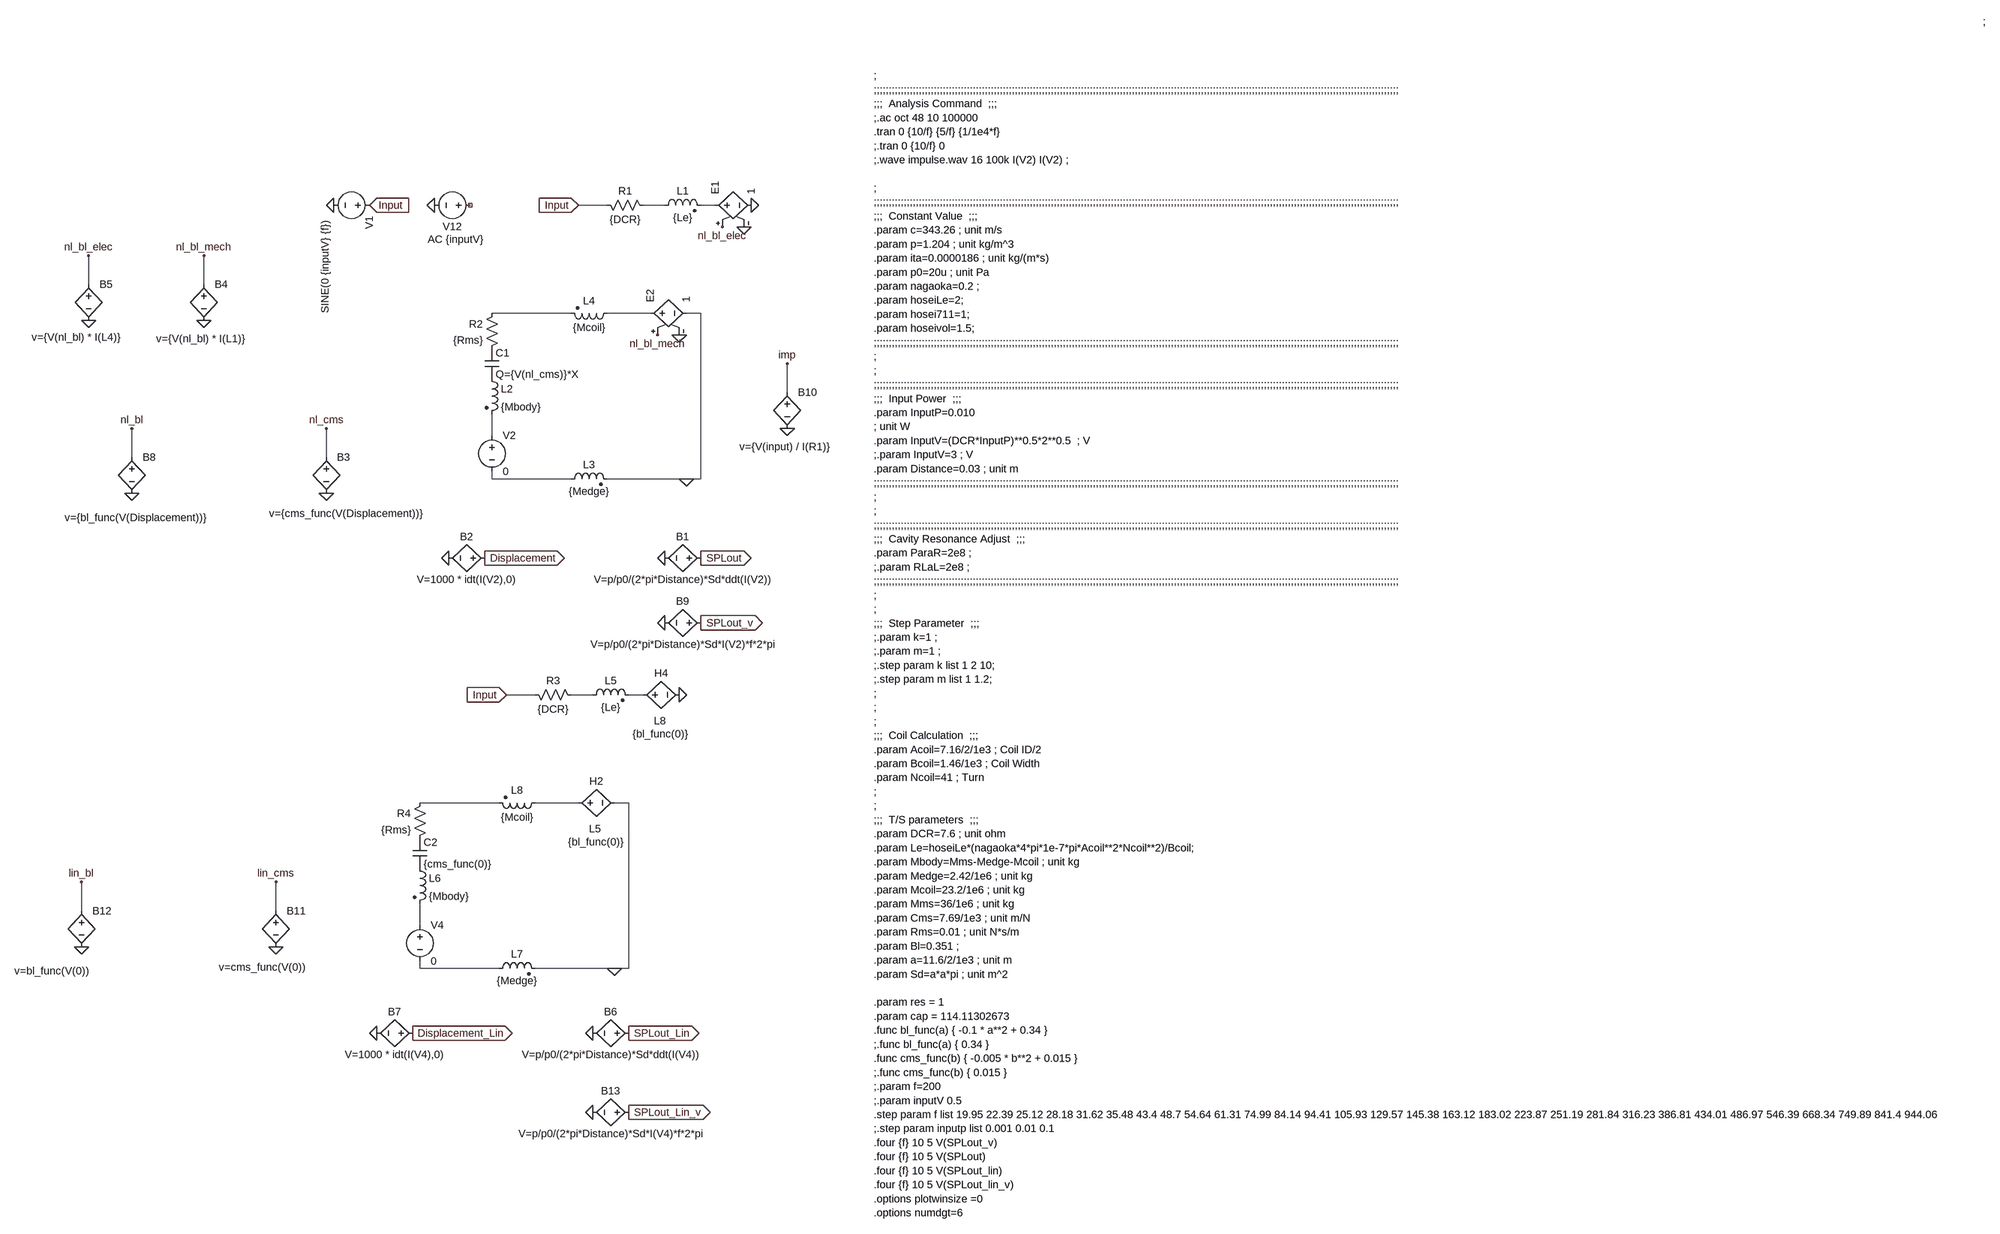
[diagram p0: schematic demo_11_10mw.asc]
demo_11_10mw.asc, the LTspice schematic file:
Version 4
SHEET 1 6896 9720
WIRE -2672 -416 -2736 -416
WIRE -2544 -416 -2592 -416
WIRE -2432 -416 -2464 -416
WIRE -3824 -240 -3824 -304
WIRE -3568 -240 -3568 -304
WIRE -2752 -176 -2928 -176
WIRE -2576 -176 -2672 -176
WIRE -2464 -176 -2496 -176
WIRE -2272 0 -2272 -64
WIRE -2928 96 -2928 48
WIRE -3728 144 -3728 80
WIRE -3296 144 -3296 80
WIRE -2928 192 -2928 176
WIRE -2752 192 -2928 192
WIRE -2496 192 -2672 192
WIRE -2464 192 -2464 -176
WIRE -2464 192 -2496 192
WIRE -2832 672 -2896 672
WIRE -2704 672 -2752 672
WIRE -2592 672 -2624 672
WIRE -2912 912 -3088 912
WIRE -2736 912 -2832 912
WIRE -2624 912 -2656 912
WIRE -3840 1152 -3840 1088
WIRE -3408 1152 -3408 1088
WIRE -3088 1184 -3088 1136
WIRE -3088 1280 -3088 1264
WIRE -2912 1280 -3088 1280
WIRE -2656 1280 -2832 1280
WIRE -2624 1280 -2624 912
WIRE -2624 1280 -2656 1280
FLAG -3056 -416 0
FLAG -3200 -416 Input
IOPIN -3200 -416 In
FLAG -2352 -416 0
FLAG -2736 -416 Input
IOPIN -2736 -416 In
FLAG -2496 192 0
FLAG -2464 368 SPLout
IOPIN -2464 368 Out
FLAG -2544 368 0
FLAG -2944 368 Displacement
IOPIN -2944 368 Out
FLAG -3024 368 0
FLAG -3280 -416 0
FLAG -3296 224 0
FLAG -3296 80 nl_cms
FLAG -3568 -160 0
FLAG -3568 -304 nl_bl_mech
FLAG -3824 -160 0
FLAG -3824 -304 nl_bl_elec
FLAG -2416 -368 nl_bl_elec
FLAG -2560 -128 nl_bl_mech
FLAG -2512 -128 0
FLAG -2368 -368 0
FLAG -2512 672 0
FLAG -2896 672 Input
IOPIN -2896 672 In
FLAG -2656 1280 0
FLAG -2624 1424 SPLout_Lin
IOPIN -2624 1424 Out
FLAG -2704 1424 0
FLAG -3104 1424 Displacement_Lin
IOPIN -3104 1424 Out
FLAG -3184 1424 0
FLAG -3728 224 0
FLAG -3728 80 nl_bl
FLAG -2464 512 SPLout_v
IOPIN -2464 512 Out
FLAG -2544 512 0
FLAG -2272 80 0
FLAG -2272 -64 imp
FLAG -3408 1232 0
FLAG -3408 1088 lin_cms
FLAG -3840 1232 0
FLAG -3840 1088 lin_bl
FLAG -2624 1600 SPLout_Lin_v
IOPIN -2624 1600 Out
FLAG -2704 1600 0
SYMBOL voltage -2960 -416 R90
WINDOW 0 32 56 VTop 2
WINDOW 3 -32 56 VBottom 2
WINDOW 123 60 48 VTop 2
SYMATTR InstName V12
SYMATTR Value ""
SYMATTR Value2 AC {inputV}
SYMBOL res -2688 -432 M90
WINDOW 0 0 56 VBottom 2
WINDOW 3 32 56 VTop 2
SYMATTR InstName R1
SYMATTR Value {DCR}
SYMBOL ind2 -2560 -400 R270
WINDOW 0 32 56 VTop 2
WINDOW 3 4 56 VBottom 2
SYMATTR InstName L1
SYMATTR Value {Le}
SYMATTR Type ind
SYMBOL res -2912 -192 M0
SYMATTR InstName R2
SYMATTR Value {Rms}
SYMBOL cap -2944 -96 R0
SYMATTR InstName C1
SYMATTR Value Q={V(nl_cms)}*X
SYMBOL h -2752 912 R270
WINDOW 0 32 56 VTop 2
WINDOW 3 -71 55 VBottom 2
WINDOW 38 -42 53 VBottom 2
SYMATTR InstName H2
SYMATTR Value {bl_func(0)}
SYMATTR SpiceModel L5
SYMBOL ind2 -2944 -48 R0
SYMATTR InstName L2
SYMATTR Value {Mbody}
SYMBOL voltage -2928 80 R0
SYMATTR InstName V2
SYMATTR Value 0
SYMBOL ind2 -2768 208 R270
WINDOW 0 32 56 VTop 2
WINDOW 3 4 56 VBottom 2
SYMATTR InstName L3
SYMATTR Value {Medge}
SYMBOL ind2 -2656 -192 R90
WINDOW 0 4 56 VBottom 2
WINDOW 3 32 56 VTop 2
SYMATTR InstName L4
SYMATTR Value {Mcoil}
SYMBOL bv -2448 368 R90
WINDOW 0 -32 56 VBottom 2
WINDOW 3 32 56 VTop 2
SYMATTR InstName B1
SYMATTR Value V=p/p0/(2*pi*Distance)*Sd*ddt(I(V2))
SYMBOL bv -2928 368 R90
WINDOW 0 -32 56 VBottom 2
WINDOW 3 32 56 VTop 2
SYMATTR InstName B2
SYMATTR Value V=1000 * idt(I(V2),0)
SYMBOL h -2608 672 R270
WINDOW 0 32 56 VTop 2
WINDOW 3 -71 55 VBottom 2
WINDOW 38 -42 53 VBottom 2
SYMATTR InstName H4
SYMATTR Value {bl_func(0)}
SYMATTR SpiceModel L8
SYMBOL voltage -3184 -416 R90
WINDOW 3 33 114 Left 2
WINDOW 123 24 38 Left 2
SYMATTR Value SINE(0 {inputV} {f})
SYMATTR InstName V1
SYMBOL bv -3296 128 R0
WINDOW 3 -127 141 Left 2
SYMATTR Value v={cms_func(V(Displacement))}
SYMATTR InstName B3
SYMBOL bv -3568 -256 R0
WINDOW 3 -106 137 Left 2
SYMATTR Value v={V(nl_bl) * I(L1)}
SYMATTR InstName B4
SYMBOL bv -3824 -256 R0
WINDOW 3 -127 133 Left 2
SYMATTR Value v={V(nl_bl) * I(L4)}
SYMATTR InstName B5
SYMBOL e -2448 -416 R270
SYMATTR InstName E1
SYMATTR Value 1
SYMBOL e -2592 -176 R270
SYMATTR InstName E2
SYMATTR Value 1
SYMBOL res -2848 656 M90
WINDOW 0 0 56 VBottom 2
WINDOW 3 32 56 VTop 2
SYMATTR InstName R3
SYMATTR Value {DCR}
SYMBOL ind2 -2720 688 R270
WINDOW 0 32 56 VTop 2
WINDOW 3 4 56 VBottom 2
SYMATTR InstName L5
SYMATTR Value {Le}
SYMATTR Type ind
SYMBOL res -3072 896 M0
SYMATTR InstName R4
SYMATTR Value {Rms}
SYMBOL cap -3104 992 R0
SYMATTR InstName C2
SYMATTR Value {cms_func(0)}
SYMBOL ind2 -3104 1040 R0
SYMATTR InstName L6
SYMATTR Value {Mbody}
SYMBOL voltage -3088 1168 R0
SYMATTR InstName V4
SYMATTR Value 0
SYMBOL ind2 -2928 1296 R270
WINDOW 0 32 56 VTop 2
WINDOW 3 4 56 VBottom 2
SYMATTR InstName L7
SYMATTR Value {Medge}
SYMBOL ind2 -2816 896 R90
WINDOW 0 4 56 VBottom 2
WINDOW 3 32 56 VTop 2
SYMATTR InstName L8
SYMATTR Value {Mcoil}
SYMBOL bv -2608 1424 R90
WINDOW 0 -32 56 VBottom 2
WINDOW 3 32 56 VTop 2
SYMATTR InstName B6
SYMATTR Value V=p/p0/(2*pi*Distance)*Sd*ddt(I(V4))
SYMBOL bv -3088 1424 R90
WINDOW 0 -32 56 VBottom 2
WINDOW 3 32 56 VTop 2
SYMATTR InstName B7
SYMATTR Value V=1000 * idt(I(V4),0)
SYMBOL bv -3728 128 R0
WINDOW 3 -149 150 Left 2
SYMATTR Value v={bl_func(V(Displacement))}
SYMATTR InstName B8
SYMBOL bv -2448 512 R90
WINDOW 0 -32 56 VBottom 2
WINDOW 3 32 56 VTop 2
SYMATTR InstName B9
SYMATTR Value V=p/p0/(2*pi*Distance)*Sd*I(V2)*f*2*pi
SYMBOL bv -2272 -16 R0
WINDOW 3 -106 137 Left 2
SYMATTR Value v={V(input) / I(R1)}
SYMATTR InstName B10
SYMBOL bv -3408 1136 R0
WINDOW 3 -127 141 Left 2
SYMATTR Value v=cms_func(V(0))
SYMATTR InstName B11
SYMBOL bv -3840 1136 R0
WINDOW 3 -149 150 Left 2
SYMATTR Value v=bl_func(V(0))
SYMATTR InstName B12
SYMBOL bv -2608 1600 R90
WINDOW 0 -32 56 VBottom 2
WINDOW 3 32 56 VTop 2
SYMATTR InstName B13
SYMATTR Value V=p/p0/(2*pi*Distance)*Sd*I(V4)*f*2*pi
TEXT -2080 -704 Left 2 !;\n;;;;;;;;;;;;;;;;;;;;;;;;;;;;;;;;;;;;;;;;;;;;;;;;;;;;;;;;;;;;;;;;;;;;;;;;;;;;;;;;;;;;;;;;;;;;;;;;;;;;;;;;;;;;;;;;;;;;;;;;;;;;;;;;;;;;;;;;;;;;;;;;;;;;;;;;;;;;;;;;;;;;;;;;;;;;;;;\n;;;  Analysis Command  ;;;\n;.ac oct 48 10 100000\n.tran 0 {10/f} {5/f} {1/1e4*f}\n;.tran 0 {10/f} 0\n;.wave impulse.wav 16 100k I(V2) I(V2) ;\n \n;\n;;;;;;;;;;;;;;;;;;;;;;;;;;;;;;;;;;;;;;;;;;;;;;;;;;;;;;;;;;;;;;;;;;;;;;;;;;;;;;;;;;;;;;;;;;;;;;;;;;;;;;;;;;;;;;;;;;;;;;;;;;;;;;;;;;;;;;;;;;;;;;;;;;;;;;;;;;;;;;;;;;;;;;;;;;;;;;;\n;;;  Constant Value  ;;;\n.param c=343.26 ; unit m/s\n.param p=1.204 ; unit kg/m^3\n.param ita=0.0000186 ; unit kg/(m*s)\n.param p0=20u ; unit Pa\n.param nagaoka=0.2 ; \n.param hoseiLe=2;\n.param hosei711=1;\n.param hoseivol=1.5;\n;;;;;;;;;;;;;;;;;;;;;;;;;;;;;;;;;;;;;;;;;;;;;;;;;;;;;;;;;;;;;;;;;;;;;;;;;;;;;;;;;;;;;;;;;;;;;;;;;;;;;;;;;;;;;;;;;;;;;;;;;;;;;;;;;;;;;;;;;;;;;;;;;;;;;;;;;;;;;;;;;;;;;;;;;;;;;;;\n;\n;\n;;;;;;;;;;;;;;;;;;;;;;;;;;;;;;;;;;;;;;;;;;;;;;;;;;;;;;;;;;;;;;;;;;;;;;;;;;;;;;;;;;;;;;;;;;;;;;;;;;;;;;;;;;;;;;;;;;;;;;;;;;;;;;;;;;;;;;;;;;;;;;;;;;;;;;;;;;;;;;;;;;;;;;;;;;;;;;;\n;;;  Input Power  ;;;\n.param InputP=0.010 \n; unit W\n.param InputV=(DCR*InputP)**0.5*2**0.5  ; V\n;.param InputV=3 ; V\n.param Distance=0.03 ; unit m\n;;;;;;;;;;;;;;;;;;;;;;;;;;;;;;;;;;;;;;;;;;;;;;;;;;;;;;;;;;;;;;;;;;;;;;;;;;;;;;;;;;;;;;;;;;;;;;;;;;;;;;;;;;;;;;;;;;;;;;;;;;;;;;;;;;;;;;;;;;;;;;;;;;;;;;;;;;;;;;;;;;;;;;;;;;;;;;;\n;\n;\n;;;;;;;;;;;;;;;;;;;;;;;;;;;;;;;;;;;;;;;;;;;;;;;;;;;;;;;;;;;;;;;;;;;;;;;;;;;;;;;;;;;;;;;;;;;;;;;;;;;;;;;;;;;;;;;;;;;;;;;;;;;;;;;;;;;;;;;;;;;;;;;;;;;;;;;;;;;;;;;;;;;;;;;;;;;;;;;\n;;;  Cavity Resonance Adjust  ;;;\n.param ParaR=2e8 ;\n;.param RLaL=2e8 ;\n;;;;;;;;;;;;;;;;;;;;;;;;;;;;;;;;;;;;;;;;;;;;;;;;;;;;;;;;;;;;;;;;;;;;;;;;;;;;;;;;;;;;;;;;;;;;;;;;;;;;;;;;;;;;;;;;;;;;;;;;;;;;;;;;;;;;;;;;;;;;;;;;;;;;;;;;;;;;;;;;;;;;;;;;;;;;;;;\n;\n;\n;;;  Step Parameter  ;;;\n;.param k=1 ;\n;.param m=1 ;\n;.step param k list 1 2 10;\n;.step param m list 1 1.2;\n;\n;\n;\n;;;  Coil Calculation  ;;;\n.param Acoil=7.16/2/1e3 ; Coil ID/2\n.param Bcoil=1.46/1e3 ; Coil Width\n.param Ncoil=41 ; Turn\n;\n;\n;;;  T/S parameters  ;;;\n.param DCR=7.6 ; unit ohm\n.param Le=hoseiLe*(nagaoka*4*pi*1e-7*pi*Acoil**2*Ncoil**2)/Bcoil; \n.param Mbody=Mms-Medge-Mcoil ; unit kg\n.param Medge=2.42/1e6 ; unit kg\n.param Mcoil=23.2/1e6 ; unit kg\n.param Mms=36/1e6 ; unit kg\n.param Cms=7.69/1e3 ; unit m/N\n.param Rms=0.01 ; unit N*s/m\n.param Bl=0.351 ;\n.param a=11.6/2/1e3 ; unit m\n.param Sd=a*a*pi ; unit m^2\n \n.param res = 1\n.param cap = 114.11302673\n.func bl_func(a) { -0.1 * a**2 + 0.34 }\n;.func bl_func(a) { 0.34 }\n.func cms_func(b) { -0.005 * b**2 + 0.015 }\n;.func cms_func(b) { 0.015 }\n;.param f=200\n;.param inputV 0.5\n.step param f list 19.95 22.39 25.12 28.18 31.62 35.48 43.4 48.7 54.64 61.31 74.99 84.14 94.41 105.93 129.57 145.38 163.12 183.02 223.87 251.19 281.84 316.23 386.81 434.01 486.97 546.39 668.34 749.89 841.4 944.06\n;.step param inputp list 0.001 0.01 0.1\n.four {f} 10 5 V(SPLout_v)\n.four {f} 10 5 V(SPLout)\n.four {f} 10 5 V(SPLout_lin)\n.four {f} 10 5 V(SPLout_lin_v) \n.options plotwinsize =0\n.options numdgt=6
TEXT 2064 -1288 Left 2 !;

The netlist it stands for:
* demo_11_10mw.asc
V12 NC_01 0 AC {inputV}
R1 Input N001 {DCR}
L1 N001 N002 {Le}
R2 N003 P001 {Rms}
C1 P001 P002 Q={V(nl_cms)}*X
H2 N010 0 L5 {bl_func(0)}
L2 P002 N005 {Mbody}
V2 N005 N006 0
L3 N006 0 {Medge}
L4 N004 N003 {Mcoil}
B1 SPLout 0 V=p/p0/(2*pi*Distance)*Sd*ddt(I(V2))
B2 Displacement 0 V=1000 * idt(I(V2),0)
H4 N008 0 L8 {bl_func(0)}
V1 Input 0 SINE(0 {inputV} {f})
B3 nl_cms 0 v={cms_func(V(Displacement))}
B4 nl_bl_mech 0 v={V(nl_bl) * I(L1)}
B5 nl_bl_elec 0 v={V(nl_bl) * I(L4)}
E1 N002 0 nl_bl_elec 0 1
E2 N004 0 nl_bl_mech 0 1
R3 Input N007 {DCR}
L5 N007 N008 {Le}
R4 N009 P003 {Rms}
C2 P003 P004 {cms_func(0)}
L6 P004 N011 {Mbody}
V4 N011 N012 0
L7 N012 0 {Medge}
L8 N010 N009 {Mcoil}
B6 SPLout_Lin 0 V=p/p0/(2*pi*Distance)*Sd*ddt(I(V4))
B7 Displacement_Lin 0 V=1000 * idt(I(V4),0)
B8 nl_bl 0 v={bl_func(V(Displacement))}
B9 SPLout_v 0 V=p/p0/(2*pi*Distance)*Sd*I(V2)*f*2*pi
B10 imp 0 v={V(input) / I(R1)}
B11 lin_cms 0 v=cms_func(V(0))
B12 lin_bl 0 v=bl_func(V(0))
B13 SPLout_Lin_v 0 V=p/p0/(2*pi*Distance)*Sd*I(V4)*f*2*pi
;
;;;;;;;;;;;;;;;;;;;;;;;;;;;;;;;;;;;;;;;;;;;;;;;;;;;;;;;;;;;;;;;;;;;;;;;;;;;;;;;;;;;;;;;;;;;;;;;;;;;;;;;;;;;;;;;;;;;;;;;;;;;;;;;;;;;;;;;;;;;;;;;;;;;;;;;;;;;;;;;;;;;;;;;;;;;;;;;
;;;  Analysis Command  ;;;
;.ac oct 48 10 100000
.tran 0 {10/f} {5/f} {1/1e4*f}
;.tran 0 {10/f} 0
;.wave impulse.wav 16 100k I(V2) I(V2) ;
;
;;;;;;;;;;;;;;;;;;;;;;;;;;;;;;;;;;;;;;;;;;;;;;;;;;;;;;;;;;;;;;;;;;;;;;;;;;;;;;;;;;;;;;;;;;;;;;;;;;;;;;;;;;;;;;;;;;;;;;;;;;;;;;;;;;;;;;;;;;;;;;;;;;;;;;;;;;;;;;;;;;;;;;;;;;;;;;;
;;;  Constant Value  ;;;
.param c=343.26 ; unit m/s
.param p=1.204 ; unit kg/m^3
.param ita=0.0000186 ; unit kg/(m*s)
.param p0=20u ; unit Pa
.param nagaoka=0.2 ;
.param hoseiLe=2;
.param hosei711=1;
.param hoseivol=1.5;
;;;;;;;;;;;;;;;;;;;;;;;;;;;;;;;;;;;;;;;;;;;;;;;;;;;;;;;;;;;;;;;;;;;;;;;;;;;;;;;;;;;;;;;;;;;;;;;;;;;;;;;;;;;;;;;;;;;;;;;;;;;;;;;;;;;;;;;;;;;;;;;;;;;;;;;;;;;;;;;;;;;;;;;;;;;;;;;
;
;
;;;;;;;;;;;;;;;;;;;;;;;;;;;;;;;;;;;;;;;;;;;;;;;;;;;;;;;;;;;;;;;;;;;;;;;;;;;;;;;;;;;;;;;;;;;;;;;;;;;;;;;;;;;;;;;;;;;;;;;;;;;;;;;;;;;;;;;;;;;;;;;;;;;;;;;;;;;;;;;;;;;;;;;;;;;;;;;
;;;  Input Power  ;;;
.param InputP=0.010
; unit W
.param InputV=(DCR*InputP)**0.5*2**0.5  ; V
;.param InputV=3 ; V
.param Distance=0.03 ; unit m
;;;;;;;;;;;;;;;;;;;;;;;;;;;;;;;;;;;;;;;;;;;;;;;;;;;;;;;;;;;;;;;;;;;;;;;;;;;;;;;;;;;;;;;;;;;;;;;;;;;;;;;;;;;;;;;;;;;;;;;;;;;;;;;;;;;;;;;;;;;;;;;;;;;;;;;;;;;;;;;;;;;;;;;;;;;;;;;
;
;
;;;;;;;;;;;;;;;;;;;;;;;;;;;;;;;;;;;;;;;;;;;;;;;;;;;;;;;;;;;;;;;;;;;;;;;;;;;;;;;;;;;;;;;;;;;;;;;;;;;;;;;;;;;;;;;;;;;;;;;;;;;;;;;;;;;;;;;;;;;;;;;;;;;;;;;;;;;;;;;;;;;;;;;;;;;;;;;
;;;  Cavity Resonance Adjust  ;;;
.param ParaR=2e8 ;
;.param RLaL=2e8 ;
;;;;;;;;;;;;;;;;;;;;;;;;;;;;;;;;;;;;;;;;;;;;;;;;;;;;;;;;;;;;;;;;;;;;;;;;;;;;;;;;;;;;;;;;;;;;;;;;;;;;;;;;;;;;;;;;;;;;;;;;;;;;;;;;;;;;;;;;;;;;;;;;;;;;;;;;;;;;;;;;;;;;;;;;;;;;;;;
;
;
;;;  Step Parameter  ;;;
;.param k=1 ;
;.param m=1 ;
;.step param k list 1 2 10;
;.step param m list 1 1.2;
;
;
;
;;;  Coil Calculation  ;;;
.param Acoil=7.16/2/1e3 ; Coil ID/2
.param Bcoil=1.46/1e3 ; Coil Width
.param Ncoil=41 ; Turn
;
;
;;;  T/S parameters  ;;;
.param DCR=7.6 ; unit ohm
.param Le=hoseiLe*(nagaoka*4*pi*1e-7*pi*Acoil**2*Ncoil**2)/Bcoil;
.param Mbody=Mms-Medge-Mcoil ; unit kg
.param Medge=2.42/1e6 ; unit kg
.param Mcoil=23.2/1e6 ; unit kg
.param Mms=36/1e6 ; unit kg
.param Cms=7.69/1e3 ; unit m/N
.param Rms=0.01 ; unit N*s/m
.param Bl=0.351 ;
.param a=11.6/2/1e3 ; unit m
.param Sd=a*a*pi ; unit m^2
.param res = 1
.param cap = 114.11302673
.func bl_func(a) { -0.1 * a**2 + 0.34 }
;.func bl_func(a) { 0.34 }
.func cms_func(b) { -0.005 * b**2 + 0.015 }
;.func cms_func(b) { 0.015 }
;.param f=200
;.param inputV 0.5
.step param f list 19.95 22.39 25.12 28.18 31.62 35.48 43.4 48.7 54.64 61.31 74.99 84.14 94.41 105.93 129.57 145.38 163.12 183.02 223.87 251.19 281.84 316.23 386.81 434.01 486.97 546.39 668.34 749.89 841.4 944.06
;.step param inputp list 0.001 0.01 0.1
.four {f} 10 5 V(SPLout_v)
.four {f} 10 5 V(SPLout)
.four {f} 10 5 V(SPLout_lin)
.four {f} 10 5 V(SPLout_lin_v)
.options plotwinsize =0
.options numdgt=6
;
.backanno
.end

* Results of the author's LTspice run, read from the files saved beside the schematic
* From the log:
*   N-Period=5
*   Fourier components of V(splout_v)
*   DC component:0.000289696
*   Harmonic  Frequency   Fourier   Normalized   Phase    Normalized
*    Number     [Hz]     Component   Component  [degree]  Phase [deg]
*       1     1.995e+01  1.355e+02  1.000e+00     87.10°      0.00°
*       2     3.990e+01  2.517e-02  1.857e-04    170.44°     83.33°
*       3     5.985e+01  4.324e+00  3.190e-02     72.00°    -15.10°
*       4     7.980e+01  2.315e-03  1.708e-05    131.88°     44.77°
*       5     9.975e+01  2.451e-01  1.808e-03     48.78°    -38.33°
*       6     1.197e+02  1.839e-03  1.357e-05    156.35°     69.25°
*       7     1.397e+02  4.167e-02  3.075e-04    -85.80°   -172.91°
*       8     1.596e+02  9.493e-04  7.004e-06     52.54°    -34.56°
*       9     1.795e+02  7.919e-02  5.843e-04     11.06°    -76.05°
*      10     1.995e+02  2.695e-03  1.988e-05     81.47°     -5.63°
*   Total Harmonic Distortion: 3.195973%(3.197050%)
*   N-Period=5
*   Fourier components of V(splout)
*   DC component:-0.00328084
*   Harmonic  Frequency   Fourier   Normalized   Phase    Normalized
*    Number     [Hz]     Component   Component  [degree]  Phase [deg]
*       1     1.995e+01  1.355e+02  1.000e+00    177.02°      0.00°
*       2     3.990e+01  5.658e-02  4.175e-04    -98.28°   -275.30°
*       3     5.985e+01  1.298e+01  9.575e-02    161.86°    -15.16°
*       4     7.980e+01  1.455e-02  1.073e-04   -116.92°   -293.94°
*       5     9.975e+01  1.217e+00  8.982e-03    141.03°    -35.99°
*       6     1.197e+02  1.777e-02  1.311e-04   -103.00°   -280.02°
*       7     1.397e+02  2.701e-01  1.993e-03      1.10°   -175.92°
*       8     1.596e+02  6.401e-03  4.722e-05   -157.51°   -334.53°
*       9     1.795e+02  6.977e-01  5.148e-03    103.17°    -73.85°
*      10     1.995e+02  2.694e-02  1.988e-04   -173.55°   -350.57°
*   Total Harmonic Distortion: 9.632847%(9.688735%)
*   N-Period=5
*   Fourier components of V(splout_lin)
*   DC component:-3.26773e-006
*   Harmonic  Frequency   Fourier   Normalized   Phase    Normalized
*    Number     [Hz]     Component   Component  [degree]  Phase [deg]
*       1     1.995e+01  1.397e+02  1.000e+00    176.92°      0.00°
*       2     3.990e+01  2.186e-04  1.565e-06     19.27°   -157.65°
*       3     5.985e+01  1.584e-02  1.133e-04   -123.81°   -300.73°
*       4     7.980e+01  5.946e-04  4.255e-06    -15.33°   -192.25°
*       5     9.975e+01  6.069e-02  4.343e-04   -125.22°   -302.15°
*       6     1.197e+02  8.332e-04  5.962e-06    -60.14°   -237.06°
*       7     1.397e+02  1.883e-02  1.347e-04   -172.15°   -349.08°
*       8     1.596e+02  7.177e-04  5.136e-06    -69.89°   -246.82°
*       9     1.795e+02  1.953e-02  1.398e-04   -156.48°   -333.41°
*      10     1.995e+02  1.322e-03  9.461e-06    -93.63°   -270.55°
*   Total Harmonic Distortion: 0.048916%(0.063350%)
*   N-Period=5
*   Fourier components of V(splout_lin_v)
*   DC component:-1.05671e-005
*   Harmonic  Frequency   Fourier   Normalized   Phase    Normalized
*    Number     [Hz]     Component   Component  [degree]  Phase [deg]
*       1     1.995e+01  1.397e+02  1.000e+00     87.02°      0.00°
*       2     3.990e+01  9.441e-06  6.756e-08   -169.09°   -256.11°
*       3     5.985e+01  3.826e-03  2.738e-05    -22.38°   -109.40°
*       4     7.980e+01  3.107e-05  2.223e-07    -62.46°   -149.47°
*       5     9.975e+01  3.201e-03  2.291e-05    144.64°     57.62°
*       6     1.197e+02  4.183e-05  2.994e-07   -146.25°   -233.27°
*       7     1.397e+02  2.323e-04  1.663e-06    -20.33°   -107.35°
*       8     1.596e+02  2.452e-05  1.755e-07   -162.27°   -249.29°
*       9     1.795e+02  4.836e-04  3.461e-06    -50.63°   -137.65°
*      10     1.995e+02  6.879e-05  4.923e-07    177.35°     90.33°
*   Total Harmonic Distortion: 0.003591%(0.000000%)
*   N-Period=5
*   Fourier components of V(splout_v)
*   DC component:-6.72184e-005
*   Harmonic  Frequency   Fourier   Normalized   Phase    Normalized
*    Number     [Hz]     Component   Component  [degree]  Phase [deg]
*       1     2.239e+01  1.710e+02  1.000e+00     86.75°      0.00°
*       2     4.478e+01  3.524e-02  2.060e-04    165.60°     78.85°
*       3     6.717e+01  5.537e+00  3.238e-02     69.79°    -16.96°
*       4     8.956e+01  3.506e-03  2.050e-05    143.80°     57.05°
*       5     1.120e+02  3.910e-01  2.286e-03     48.70°    -38.05°
*       6     1.343e+02  2.483e-03  1.451e-05    130.23°     43.48°
*       7     1.567e+02  1.149e-01  6.718e-04   -140.73°   -227.48°
*       8     1.791e+02  1.825e-03  1.067e-05    104.89°     18.14°
*       9     2.015e+02  2.166e-01  1.266e-03      3.00°    -83.75°
*      10     2.239e+02  2.811e-03  1.643e-05     96.84°     10.09°
*   Total Harmonic Distortion: 3.248827%(3.250581%)
*   N-Period=5
*   Fourier components of V(splout)
*   DC component:-0.00152878
*   Harmonic  Frequency   Fourier   Normalized   Phase    Normalized
*    Number     [Hz]     Component   Component  [degree]  Phase [deg]
*       1     2.239e+01  1.710e+02  1.000e+00    176.68°      0.00°
*       2     4.478e+01  7.355e-02  4.300e-04   -103.85°   -280.53°
*       3     6.717e+01  1.660e+01  9.708e-02    159.61°    -17.06°
*       4     8.956e+01  1.656e-02  9.681e-05   -119.78°   -296.45°
*       5     1.120e+02  1.940e+00  1.134e-02    139.22°    -37.46°
*       6     1.343e+02  1.693e-02  9.900e-05   -131.07°   -307.75°
*       7     1.567e+02  8.186e-01  4.786e-03    -52.12°   -228.79°
*       8     1.791e+02  1.550e-02  9.065e-05   -153.95°   -330.63°
*       9     2.015e+02  1.919e+00  1.122e-02     92.80°    -83.87°
*      10     2.239e+02  2.823e-02  1.651e-04   -167.19°   -343.87°
*   Total Harmonic Distortion: 9.850233%(9.932476%)
*   N-Period=5
*   Fourier components of V(splout_lin)
*   DC component:8.80531e-006
*   Harmonic  Frequency   Fourier   Normalized   Phase    Normalized
*    Number     [Hz]     Component   Component  [degree]  Phase [deg]
*       1     2.239e+01  1.763e+02  1.000e+00    176.57°      0.00°
*       2     4.478e+01  1.294e-04  7.338e-07    -33.48°   -210.05°
*       3     6.717e+01  7.376e-03  4.182e-05    -74.86°   -251.43°
*       4     8.956e+01  7.288e-05  4.133e-07    -47.69°   -224.26°
*       5     1.120e+02  3.588e-02  2.034e-04   -114.58°   -291.15°
*       6     1.343e+02  3.144e-04  1.783e-06    -10.46°   -187.03°
*       7     1.567e+02  1.362e-02  7.724e-05    -22.54°   -199.11°
*       8     1.791e+02  2.705e-04  1.534e-06    -81.61°   -258.18°
*       9     2.015e+02  3.046e-02  1.727e-04   -152.27°   -328.84°
*      10     2.239e+02  4.676e-04  2.652e-06    -20.76°   -197.33°
*   Total Harmonic Distortion: 0.028098%(0.039025%)
*   N-Period=5
*   Fourier components of V(splout_lin_v)
*   DC component:7.57898e-006
*   Harmonic  Frequency   Fourier   Normalized   Phase    Normalized
*    Number     [Hz]     Component   Component  [degree]  Phase [deg]
*       1     2.239e+01  1.763e+02  1.000e+00     86.65°      0.00°
*       2     4.478e+01  8.545e-06  4.846e-08    -71.13°   -157.78°
*       3     6.717e+01  2.912e-03  1.651e-05    -20.96°   -107.61°
*       4     8.956e+01  1.655e-05  9.388e-08    116.04°     29.39°
*       5     1.120e+02  3.024e-03  1.715e-05    139.95°     53.30°
*       6     1.343e+02  1.315e-05  7.457e-08    -53.51°   -140.15°
*       7     1.567e+02  2.440e-03  1.383e-05    -65.80°   -152.45°
*       8     1.791e+02  2.639e-05  1.496e-07    128.76°     42.11°
*       9     2.015e+02  2.120e-03  1.202e-05     74.60°    -12.05°
*      10     2.239e+02  1.182e-05  6.701e-08    -89.88°   -176.53°
*   Total Harmonic Distortion: 0.003004%(0.000000%)
*   N-Period=5
*   Fourier components of V(splout_v)
*   DC component:0.00726347
*   Harmonic  Frequency   Fourier   Normalized   Phase    Normalized
*    Number     [Hz]     Component   Component  [degree]  Phase [deg]
*       1     2.512e+01  2.159e+02  1.000e+00     86.34°      0.00°
*       2     5.024e+01  6.809e-02  3.154e-04     -7.46°    -93.80°
*       3     7.536e+01  7.284e+00  3.374e-02     67.24°    -19.10°
*       4     1.005e+02  2.123e-02  9.831e-05    -35.04°   -121.38°
*       5     1.256e+02  5.466e-01  2.532e-03     43.81°    -42.53°
*       6     1.507e+02  1.805e-02  8.359e-05   -106.07°   -192.41°
*       7     1.758e+02  2.026e-01  9.385e-04   -162.30°   -248.64°
*       8     2.010e+02  1.757e-02  8.137e-05    162.17°     75.83°
*       9     2.261e+02  7.606e-02  3.523e-04     56.28°    -30.06°
*      10     2.512e+02  1.622e-02  7.514e-05     42.95°    -43.39°
*   Total Harmonic Distortion: 3.384733%(3.386659%)
*   N-Period=5
*   Fourier components of V(splout)
*   DC component:0.00992903
*   Harmonic  Frequency   Fourier   Normalized   Phase    Normalized
*    Number     [Hz]     Component   Component  [degree]  Phase [deg]
*       1     2.512e+01  2.159e+02  1.000e+00    176.28°      0.00°
*       2     5.024e+01  1.559e-01  7.221e-04     83.84°    -92.45°
*       3     7.536e+01  2.185e+01  1.012e-01    157.03°    -19.25°
*       4     1.005e+02  1.027e-01  4.755e-04     62.04°   -114.24°
*       5     1.256e+02  2.722e+00  1.261e-02    133.97°    -42.31°
*       6     1.507e+02  1.035e-01  4.795e-04     -4.79°   -181.07°
*       7     1.758e+02  1.406e+00  6.513e-03    -72.27°   -248.55°
*       8     2.010e+02  1.199e-01  5.554e-04   -111.33°   -287.61°
*       9     2.261e+02  6.840e-01  3.168e-03    147.37°    -28.92°
*      10     2.512e+02  1.777e-01  8.230e-04    127.58°    -48.70°
*   Total Harmonic Distortion: 10.225719%(10.302760%)
*   N-Period=5
*   Fourier components of V(splout_lin)
*   DC component:-0.000459067
*   Harmonic  Frequency   Fourier   Normalized   Phase    Normalized
*    Number     [Hz]     Component   Component  [degree]  Phase [deg]
*       1     2.512e+01  2.225e+02  1.000e+00    176.17°      0.00°
*       2     5.024e+01  1.004e-03  4.515e-06   -119.81°   -295.98°
*       3     7.536e+01  1.497e-02  6.730e-05    -87.60°   -263.78°
*       4     1.005e+02  1.208e-03  5.431e-06   -163.12°   -339.29°
*       5     1.256e+02  2.885e-02  1.296e-04   -112.10°   -288.28°
*       6     1.507e+02  1.197e-03  5.379e-06    143.43°    -32.75°
*       7     1.758e+02  1.904e-02  8.555e-05    -46.67°   -222.85°
*       8     2.010e+02  1.425e-03  6.403e-06     61.17°   -115.01°
*       9     2.261e+02  1.802e-02  8.097e-05   -169.53°   -345.70°
*      10     2.512e+02  1.435e-03  6.448e-06    -62.42°   -238.59°
*   Total Harmonic Distortion: 0.018808%(0.028393%)
*   N-Period=5
*   Fourier components of V(splout_lin_v)
*   DC component:-3.99761e-005
*   Harmonic  Frequency   Fourier   Normalized   Phase    Normalized
*    Number     [Hz]     Component   Component  [degree]  Phase [deg]
*       1     2.512e+01  2.225e+02  1.000e+00     86.23°      0.00°
*       2     5.024e+01  1.050e-04  4.717e-07   -150.69°   -236.92°
*       3     7.536e+01  1.507e-03  6.773e-06    -21.11°   -107.34°
*       4     1.005e+02  1.249e-04  5.613e-07    127.96°     41.73°
*       5     1.256e+02  2.346e-03  1.054e-05    130.62°     44.38°
*       6     1.507e+02  1.189e-04  5.344e-07     54.88°    -31.35°
*       7     1.758e+02  2.053e-03  9.225e-06    -77.59°   -163.82°
*       8     2.010e+02  1.502e-04  6.749e-07    -31.63°   -117.86°
*       9     2.261e+02  2.365e-03  1.063e-05     47.07°    -39.16°
*      10     2.512e+02  1.122e-04  5.042e-07   -154.69°   -240.93°
*   Total Harmonic Distortion: 0.001889%(0.000000%)
*   N-Period=5
*   Fourier components of V(splout_v)
*   DC component:-0.0181083
*   Harmonic  Frequency   Fourier   Normalized   Phase    Normalized
*    Number     [Hz]     Component   Component  [degree]  Phase [deg]
*       1     2.818e+01  2.740e+02  1.000e+00     85.73°      0.00°
*       2     5.636e+01  3.001e-01  1.095e-03    -18.67°   -104.40°
*       3     8.454e+01  8.466e+00  3.090e-02     58.85°    -26.87°
*       4     1.127e+02  3.614e-02  1.319e-04     20.17°    -65.55°
*       5     1.409e+02  6.239e-01  2.277e-03     98.02°     12.30°
*       6     1.691e+02  8.239e-02  3.007e-04     12.82°    -72.91°
*       7     1.973e+02  1.936e+00  7.067e-03    145.52°     59.80°
*       8     2.254e+02  4.236e-02  1.546e-04    -91.98°   -177.71°
*       9     2.536e+02  1.083e-01  3.952e-04     74.34°    -11.39°
*      10     2.818e+02  4.267e-02  1.557e-04     37.74°    -47.98°
*   Total Harmonic Distortion: 3.180482%(3.187905%)
*   N-Period=5
*   Fourier components of V(splout)
*   DC component:0.0773606
*   Harmonic  Frequency   Fourier   Normalized   Phase    Normalized
*    Number     [Hz]     Component   Component  [degree]  Phase [deg]
*       1     2.818e+01  2.740e+02  1.000e+00    175.66°      0.00°
*       2     5.636e+01  7.482e-01  2.731e-03     75.07°   -100.59°
*       3     8.454e+01  2.550e+01  9.305e-02    148.38°    -27.28°
*       4     1.127e+02  2.941e-01  1.073e-03    100.01°    -75.65°
*       5     1.409e+02  3.079e+00  1.124e-02   -174.25°   -349.91°
*       6     1.691e+02  6.454e-01  2.355e-03     99.89°    -75.77°
*       7     1.973e+02  1.341e+01  4.895e-02   -124.97°   -300.62°
*       8     2.254e+02  3.653e-01  1.333e-03     22.74°   -152.92°
*       9     2.536e+02  1.023e+00  3.734e-03    157.30°    -18.36°
*      10     2.818e+02  5.602e-01  2.044e-03    117.76°    -57.89°
*   Total Harmonic Distortion: 10.590167%(10.884772%)
*   N-Period=5
*   Fourier components of V(splout_lin)
*   DC component:-0.000602845
*   Harmonic  Frequency   Fourier   Normalized   Phase    Normalized
*    Number     [Hz]     Component   Component  [degree]  Phase [deg]
*       1     2.818e+01  2.809e+02  1.000e+00    175.72°      0.00°
*       2     5.636e+01  1.711e-03  6.090e-06   -108.00°   -283.72°
*       3     8.454e+01  2.276e-02  8.105e-05    136.87°    -38.85°
*       4     1.127e+02  2.867e-03  1.021e-05   -127.21°   -302.93°
*       5     1.409e+02  2.756e-02  9.813e-05    -64.39°   -240.11°
*       6     1.691e+02  3.829e-03  1.363e-05   -151.51°   -327.23°
*       7     1.973e+02  4.355e-02  1.551e-04    -55.90°   -231.62°
*       8     2.254e+02  3.382e-03  1.204e-05   -178.39°   -354.11°
*       9     2.536e+02  3.091e-02  1.101e-04    -73.27°   -248.99°
*      10     2.818e+02  2.436e-03  8.674e-06    157.31°    -18.41°
*   Total Harmonic Distortion: 0.023001%(0.029478%)
*   N-Period=5
*   Fourier components of V(splout_lin_v)
*   DC component:-3.50132e-005
*   Harmonic  Frequency   Fourier   Normalized   Phase    Normalized
*    Number     [Hz]     Component   Component  [degree]  Phase [deg]
*       1     2.818e+01  2.808e+02  1.000e+00     85.76°      0.00°
*       2     5.636e+01  5.197e-05  1.851e-07   -115.61°   -201.38°
*       3     8.454e+01  3.187e-03  1.135e-05     17.56°    -68.20°
*       4     1.127e+02  2.297e-05  8.180e-08    153.91°     68.15°
*       5     1.409e+02  2.379e-03  8.471e-06     75.33°    -10.44°
*       6     1.691e+02  7.573e-05  2.697e-07     48.70°    -37.06°
*       7     1.973e+02  2.207e-03  7.859e-06    153.14°     67.38°
*       8     2.254e+02  1.181e-04  4.204e-07    -18.98°   -104.74°
*       9     2.536e+02  1.217e-03  4.335e-06    165.64°     79.88°
*      10     2.818e+02  7.139e-05  2.542e-07    -66.17°   -151.94°
*   Total Harmonic Distortion: 0.001678%(0.000000%)
*   N-Period=5
*   Fourier components of V(splout_v)
*   DC component:-0.00841727
*   Harmonic  Frequency   Fourier   Normalized   Phase    Normalized
*    Number     [Hz]     Component   Component  [degree]  Phase [deg]
*       1     3.162e+01  3.477e+02  1.000e+00     85.33°      0.00°
*       2     6.324e+01  4.621e-01  1.329e-03    -19.49°   -104.82°
*       3     9.486e+01  9.470e+00  2.723e-02     59.56°    -25.77°
*       4     1.265e+02  3.287e-02  9.454e-05    -72.07°   -157.40°
*       5     1.581e+02  1.960e+00  5.636e-03   -145.67°   -231.00°
*       6     1.897e+02  3.535e-02  1.017e-04   -138.91°   -224.24°
*       7     2.213e+02  1.252e+00  3.600e-03    -26.43°   -111.76°
*       8     2.530e+02  1.360e-02  3.910e-05    175.17°     89.84°
*       9     2.846e+02  2.119e-01  6.095e-04    108.51°     23.18°
*      10     3.162e+02  3.340e-02  9.605e-05      1.35°    -83.98°
*   Total Harmonic Distortion: 2.808130%(2.809668%)
*   N-Period=5
*   Fourier components of V(splout)
*   DC component:-0.0253203
*   Harmonic  Frequency   Fourier   Normalized   Phase    Normalized
*    Number     [Hz]     Component   Component  [degree]  Phase [deg]
*       1     3.162e+01  3.477e+02  1.000e+00    175.30°      0.00°
*       2     6.324e+01  8.768e-01  2.522e-03     69.23°   -106.07°
*       3     9.486e+01  2.840e+01  8.168e-02    149.44°    -25.86°
*       4     1.265e+02  1.249e-01  3.592e-04     -4.85°   -180.15°
*       5     1.581e+02  9.880e+00  2.841e-02    -56.21°   -231.51°
*       6     1.897e+02  2.528e-01  7.269e-04    -56.67°   -231.97°
*       7     2.213e+02  8.722e+00  2.508e-02     63.21°   -112.09°
*       8     2.530e+02  1.596e-01  4.589e-04    -93.55°   -268.85°
*       9     2.846e+02  1.921e+00  5.524e-03   -159.98°   -335.28°
*      10     3.162e+02  2.838e-01  8.161e-04     91.28°    -84.02°
*   Total Harmonic Distortion: 9.025854%(9.129746%)
*   N-Period=5
*   Fourier components of V(splout_lin)
*   DC component:3.95933e-005
*   Harmonic  Frequency   Fourier   Normalized   Phase    Normalized
*    Number     [Hz]     Component   Component  [degree]  Phase [deg]
*       1     3.162e+01  3.549e+02  1.000e+00    175.18°      0.00°
*       2     6.324e+01  1.156e-04  3.258e-07     21.67°   -153.51°
*       3     9.486e+01  2.015e-02  5.678e-05     65.90°   -109.29°
*       4     1.265e+02  2.404e-04  6.772e-07    -65.47°   -240.66°
*       5     1.581e+02  3.734e-02  1.052e-04   -117.87°   -293.06°
*       6     1.897e+02  2.400e-04  6.763e-07      3.64°   -171.55°
*       7     2.213e+02  3.912e-03  1.102e-05    150.72°    -24.46°
*       8     2.530e+02  6.229e-04  1.755e-06   -110.63°   -285.82°
*       9     2.846e+02  1.730e-02  4.875e-05    -86.43°   -261.61°
*      10     3.162e+02  2.476e-04  6.976e-07    151.18°    -24.01°
*   Total Harmonic Distortion: 0.012960%(0.019961%)
*   N-Period=5
*   Fourier components of V(splout_lin_v)
*   DC component:-4.82639e-006
*   Harmonic  Frequency   Fourier   Normalized   Phase    Normalized
*    Number     [Hz]     Component   Component  [degree]  Phase [deg]
*       1     3.162e+01  3.549e+02  1.000e+00     85.23°      0.00°
*       2     6.324e+01  5.881e-05  1.657e-07    -73.91°   -159.14°
*       3     9.486e+01  4.782e-03  1.348e-05    -21.66°   -106.88°
*       4     1.265e+02  6.318e-05  1.780e-07   -158.74°   -243.97°
*       5     1.581e+02  2.971e-03  8.372e-06    129.68°     44.45°
*       6     1.897e+02  4.036e-05  1.137e-07   -105.02°   -190.25°
*       7     2.213e+02  5.345e-04  1.506e-06     94.92°      9.70°
*       8     2.530e+02  7.812e-05  2.201e-07    159.89°     74.67°
*       9     2.846e+02  9.444e-04  2.661e-06   -142.67°   -227.90°
*      10     3.162e+02  2.473e-05  6.967e-08     68.53°    -16.69°
*   Total Harmonic Distortion: 0.001616%(0.000000%)
*   N-Period=5
*   Fourier components of V(splout_v)
*   DC component:0.00786738
*   Harmonic  Frequency   Fourier   Normalized   Phase    Normalized
*    Number     [Hz]     Component   Component  [degree]  Phase [deg]
*       1     3.548e+01  4.408e+02  1.000e+00     84.74°      0.00°
*       2     7.096e+01  5.619e-01  1.275e-03    -21.60°   -106.34°
*       3     1.064e+02  1.254e+01  2.845e-02     55.37°    -29.37°
*       4     1.419e+02  7.385e-02  1.676e-04    174.53°     89.80°
*       5     1.774e+02  4.275e+00  9.698e-03   -160.98°   -245.71°
*       6     2.129e+02  5.866e-02  1.331e-04     68.20°    -16.54°
*       7     2.484e+02  1.664e-01  3.775e-04     34.95°    -49.79°
*       8     2.838e+02  5.097e-02  1.156e-04   -143.39°   -228.13°
*       9     3.193e+02  9.653e-02  2.190e-04    117.07°     32.33°
*      10     3.548e+02  7.703e-03  1.748e-05    176.72°     91.98°
*   Total Harmonic Distortion: 3.008945%(3.011414%)
*   N-Period=5
*   Fourier components of V(splout)
*   DC component:0.0149723
*   Harmonic  Frequency   Fourier   Normalized   Phase    Normalized
*    Number     [Hz]     Component   Component  [degree]  Phase [deg]
*       1     3.548e+01  4.408e+02  1.000e+00    174.71°      0.00°
*       2     7.096e+01  1.152e+00  2.613e-03     68.83°   -105.88°
*       3     1.064e+02  3.766e+01  8.543e-02    145.18°    -29.54°
*       4     1.419e+02  2.657e-01  6.028e-04    -96.40°   -271.11°
*       5     1.774e+02  2.138e+01  4.851e-02    -71.16°   -245.87°
*       6     2.129e+02  3.637e-01  8.252e-04    153.68°    -21.03°
*       7     2.484e+02  1.195e+00  2.712e-03    123.51°    -51.20°
*       8     2.838e+02  3.842e-01  8.716e-04    -50.94°   -225.65°
*       9     3.193e+02  8.604e-01  1.952e-03   -154.58°   -329.30°
*      10     3.548e+02  4.735e-02  1.074e-04    -95.49°   -270.21°
*   Total Harmonic Distortion: 9.834536%(9.943408%)
*   N-Period=5
*   Fourier components of V(splout_lin)
*   DC component:1.22384e-005
*   Harmonic  Frequency   Fourier   Normalized   Phase    Normalized
*    Number     [Hz]     Component   Component  [degree]  Phase [deg]
*       1     3.548e+01  4.490e+02  1.000e+00    174.59°      0.00°
*       2     7.096e+01  2.901e-05  6.462e-08    104.79°    -69.80°
*       3     1.064e+02  5.477e-03  1.220e-05   -100.05°   -274.64°
*       4     1.419e+02  4.829e-05  1.076e-07    105.67°    -68.92°
*       5     1.774e+02  5.539e-03  1.234e-05   -109.81°   -284.40°
*       6     2.129e+02  7.818e-05  1.741e-07     67.61°   -106.98°
*       7     2.484e+02  4.920e-03  1.096e-05   -117.45°   -292.05°
*       8     2.838e+02  5.568e-05  1.240e-07     30.33°   -144.26°
*       9     3.193e+02  4.810e-03  1.071e-05   -119.74°   -294.33°
*      10     3.548e+02  3.938e-05  8.771e-08     20.35°   -154.24°
*   Total Harmonic Distortion: 0.002315%(0.007107%)
*   N-Period=5
*   Fourier components of V(splout_lin_v)
*   DC component:2.20269e-006
*   Harmonic  Frequency   Fourier   Normalized   Phase    Normalized
*    Number     [Hz]     Component   Component  [degree]  Phase [deg]
*       1     3.548e+01  4.490e+02  1.000e+00     84.62°      0.00°
*       2     7.096e+01  4.918e-06  1.095e-08     65.57°    -19.04°
*       3     1.064e+02  4.916e-05  1.095e-07    116.65°     32.03°
*       4     1.419e+02  6.718e-06  1.496e-08     36.53°    -48.08°
*       5     1.774e+02  1.023e-04  2.278e-07     90.83°      6.21°
*       6     2.129e+02  8.872e-06  1.976e-08    -27.55°   -112.17°
*       7     2.484e+02  1.077e-04  2.399e-07     29.70°    -54.92°
*       8     2.838e+02  5.293e-06  1.179e-08    -83.76°   -168.38°
*       9     3.193e+02  6.707e-05  1.494e-07     -2.18°    -86.80°
*      10     3.548e+02  3.116e-06  6.941e-09   -106.99°   -191.61°
*   Total Harmonic Distortion: 0.000038%(0.001522%)
*   N-Period=5
*   Fourier components of V(splout_v)
*   DC component:0.00586648
*   Harmonic  Frequency   Fourier   Normalized   Phase    Normalized
*    Number     [Hz]     Component   Component  [degree]  Phase [deg]
*       1     4.340e+01  6.629e+02  1.000e+00     83.49°      0.00°
*       2     8.680e+01  1.003e+00  1.513e-03    -25.59°   -109.09°
*       3     1.302e+02  3.152e+01  4.754e-02     44.01°    -39.49°
*       4     1.736e+02  2.956e-01  4.459e-04    129.10°     45.61°
*       5     2.170e+02  1.661e+01  2.505e-02    167.69°     84.19°
*       6     2.604e+02  1.832e-01  2.764e-04    -81.01°   -164.50°
*       7     3.038e+02  3.380e+00  5.098e-03    -32.95°   -116.44°
*       8     3.472e+02  1.770e-02  2.669e-05    151.04°     67.54°
*       9     3.906e+02  4.771e-01  7.197e-04   -146.12°   -229.62°
*      10     4.340e+02  5.933e-03  8.949e-06   -172.32°   -255.82°
*   Total Harmonic Distortion: 5.401026%(5.402085%)